# Altium schematic sheet EEG_1.SchDoc
size A3
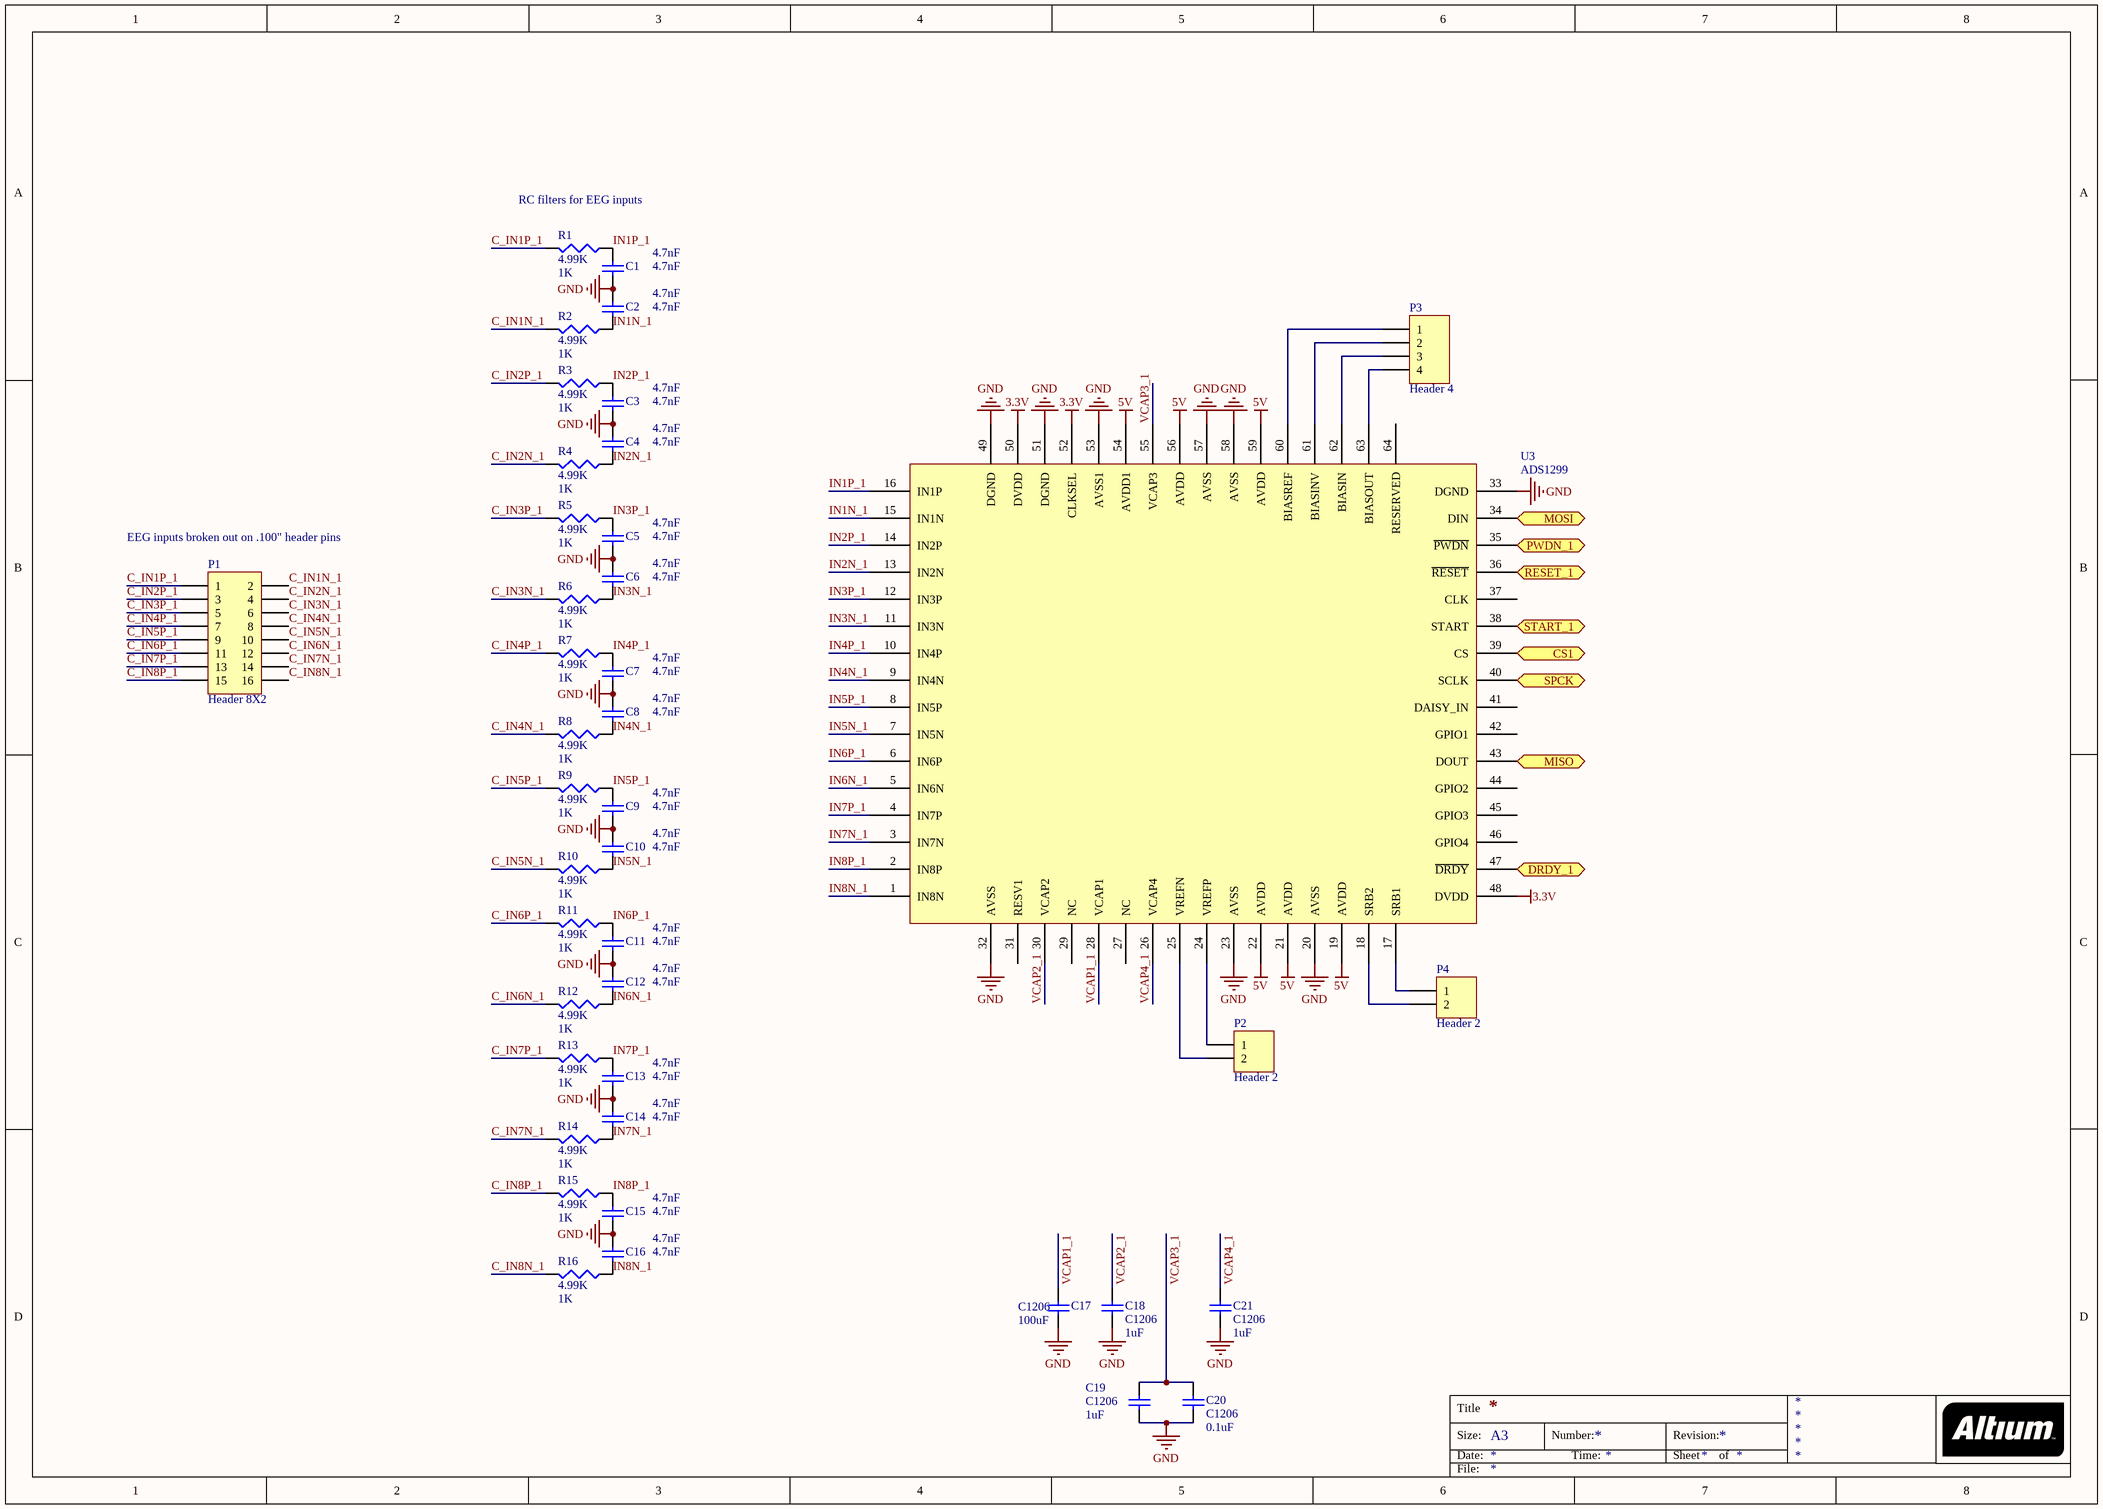
[diagram p0: EEG_1.SchDoc]

## Parts
C1  4.7nF  [1608[0603]]
C2  4.7nF  [1608[0603]]
C3  4.7nF  [1608[0603]]
C4  4.7nF  [1608[0603]]
C5  4.7nF  [1608[0603]]
C6  4.7nF  [1608[0603]]
C7  4.7nF  [1608[0603]]
C8  4.7nF  [1608[0603]]
C9  4.7nF  [1608[0603]]
C10  4.7nF  [1608[0603]]
C11  4.7nF  [1608[0603]]
C12  4.7nF  [1608[0603]]
C13  4.7nF  [1608[0603]]
C14  4.7nF  [1608[0603]]
C15  4.7nF  [1608[0603]]
C16  4.7nF  [1608[0603]]
C17  C1206  value 100uF  [1608[0603]]
C18  C1206  value 1uF  [1608[0603]]
C19  C1206  value 1uF  [1608[0603]]
C20  C1206  value 0.1uF  [1608[0603]]
C21  C1206  value 1uF  [1608[0603]]
P1  Header 8X2  [HDR2X8]
P2  Header 2  [HDR1X2]
P3  Header 4  [HDR1X4]
P4  Header 2  [HDR1X2]
R1  4.99K  value 1K  [1608[0603]]
R2  4.99K  value 1K  [1608[0603]]
R3  4.99K  value 1K  [1608[0603]]
R4  4.99K  value 1K  [1608[0603]]
R5  4.99K  value 1K  [1608[0603]]
R6  4.99K  value 1K  [1608[0603]]
R7  4.99K  value 1K  [1608[0603]]
R8  4.99K  value 1K  [1608[0603]]
R9  4.99K  value 1K  [1608[0603]]
R10  4.99K  value 1K  [1608[0603]]
R11  4.99K  value 1K  [1608[0603]]
R12  4.99K  value 1K  [1608[0603]]
R13  4.99K  value 1K  [1608[0603]]
R14  4.99K  value 1K  [1608[0603]]
R15  4.99K  value 1K  [1608[0603]]
R16  4.99K  value 1K  [1608[0603]]
U3  ADS1299  [ADS1299 Plastic QFP]

## Ports
CS1, DRDY_1, MISO, MOSI, PWDN_1, RESET_1, SPCK, START_1

## Nets
3.3V: U3.48(DVDD) U3.50(DVDD) U3.52(CLKSEL)
5V: U3.19(AVDD) U3.21(AVDD) U3.22(AVDD) U3.54(AVDD1) U3.56(AVDD) U3.59(AVDD)
GND: C1.1 C2.2 C3.1 C4.2 C5.1 C6.2 C7.1 C8.2 C9.1 C10.2 C11.1 C12.2 C13.1 C14.2 C15.1 C16.2 C17.2 C18.1 C19.2 C20.1 C21.1 U3.20(AVSS) U3.23(AVSS) U3.32(AVSS) U3.33(DGND) U3.49(DGND) U3.51(DGND) U3.53(AVSS1) U3.57(AVSS) U3.58(AVSS)
C_IN1N_1: P1.2 R2.2
C_IN1P_1: P1.1 R1.2
C_IN2N_1: P1.4 R4.2
C_IN2P_1: P1.3 R3.2
C_IN3N_1: P1.6 R6.2
C_IN3P_1: P1.5 R5.2
C_IN4N_1: P1.8 R8.2
C_IN4P_1: P1.7 R7.2
C_IN5N_1: P1.10 R10.2
C_IN5P_1: P1.9 R9.2
C_IN6N_1: P1.12 R12.2
C_IN6P_1: P1.11 R11.2
C_IN7N_1: P1.14 R14.2
C_IN7P_1: P1.13 R13.2
C_IN8N_1: P1.16 R16.2
C_IN8P_1: P1.15 R15.2
CS1: U3.39(CS) ; port CS1
DRDY_1: U3.47(~{DRDY}) ; port DRDY_1
IN1N_1: C2.1 R2.1 U3.15(IN1N)
IN1P_1: C1.2 R1.1 U3.16(IN1P)
IN2N_1: C4.1 R4.1 U3.13(IN2N)
IN2P_1: C3.2 R3.1 U3.14(IN2P)
IN3N_1: C6.1 R6.1 U3.11(IN3N)
IN3P_1: C5.2 R5.1 U3.12(IN3P)
IN4N_1: C8.1 R8.1 U3.9(IN4N)
IN4P_1: C7.2 R7.1 U3.10(IN4P)
IN5N_1: C10.1 R10.1 U3.7(IN5N)
IN5P_1: C9.2 R9.1 U3.8(IN5P)
IN6N_1: C12.1 R12.1 U3.5(IN6N)
IN6P_1: C11.2 R11.1 U3.6(IN6P)
IN7N_1: C14.1 R14.1 U3.3(IN7N)
IN7P_1: C13.2 R13.1 U3.4(IN7P)
IN8N_1: C16.1 R16.1 U3.1(IN8N)
IN8P_1: C15.2 R15.1 U3.2(IN8P)
MISO: U3.43(DOUT) ; port MISO
MOSI: U3.34(DIN) ; port MOSI
PWDN_1: U3.35(~{PWDN}) ; port PWDN_1
RESET_1: U3.36(~{RESET}) ; port RESET_1
SPCK: U3.40(SCLK) ; port SPCK
START_1: U3.38(START) ; port START_1
VCAP1_1: C17.1 U3.28(VCAP1)
VCAP2_1: C18.2 U3.30(VCAP2)
VCAP3_1: C19.1 C20.2 U3.55(VCAP3)
VCAP4_1: C21.2 U3.26(VCAP4)
NetP2_1: P2.1 U3.24(VREFP)
NetP2_2: P2.2 U3.25(VREFN)
NetP3_1: P3.1 U3.60(BIASREF)
NetP3_2: P3.2 U3.61(BIASINV)
NetP3_3: P3.3 U3.62(BIASIN)
NetP3_4: P3.4 U3.63(BIASOUT)
NetP4_1: P4.1 U3.17(SRB1)
NetP4_2: P4.2 U3.18(SRB2)

Not connected (* = marked no-connect by the designer): U3 27(NC) 29(NC) 31(RESV1) 37(CLK) 41(DAISY_IN) 42(GPIO1) 44(GPIO2) 45(GPIO3) 46(GPIO4) 64(RESERVED)

## Notes on the sheet
- RC filters for EEG inputs
- (near P1) EEG inputs broken out on .100" header pins
- Title
- Size:
- Date:
- A3
- Number:
- Time:
- Revision:
- Sheet
- of
- File:

## Library data of the parts
C1-C21 = Cap Semi: Capacitor (Semiconductor SIM Model); Published: 8-Jun-2000; LatestRevisionDate: 29-May-2009; LatestRevisionNote: IPC-7351 Footprint Added.; PackageReference: C1206; Publisher: Altium Limited; PackageDescription: Chip Capacitor
  C1-C16: Value: 4.7nF
P1 = Header 8X2: Header, 8-Pin, Dual row; LatestRevisionDate: 17-Jul-2002; LatestRevisionNote: Re-released for DXP Platform.; Publisher: Altium Limited
P2 P4 = Header 2: Header, 2-Pin; LatestRevisionDate: 17-Jul-2002; LatestRevisionNote: Re-released for DXP Platform.; Publisher: Altium Limited
P3 = Header 4: Header, 4-Pin; LatestRevisionDate: 17-Jul-2002; LatestRevisionNote: Re-released for DXP Platform.; Publisher: Altium Limited
R1-R16 = Res3: Resistor; Published: 8-Jun-2000; LatestRevisionDate: 29-May-2009; LatestRevisionNote: IPC-7351 Footprint Added.; PackageReference: J1-0603; Publisher: Altium Limited; PackageDescription: Chip Resistor